# Altium schematic sheet ORD_CONNECTORS.SchDoc
size 420 x 297 mm; Address1: Address1; Address2: Address2; Address3: Address3; Address4: Address4; DocumentNumber: АБВГ.123456.001 Э3; SheetNumber: 1; Scale: 1:1; DocumentType: Схема электрическая принципиальная; FirstReferrence: АБВГ.123456.001
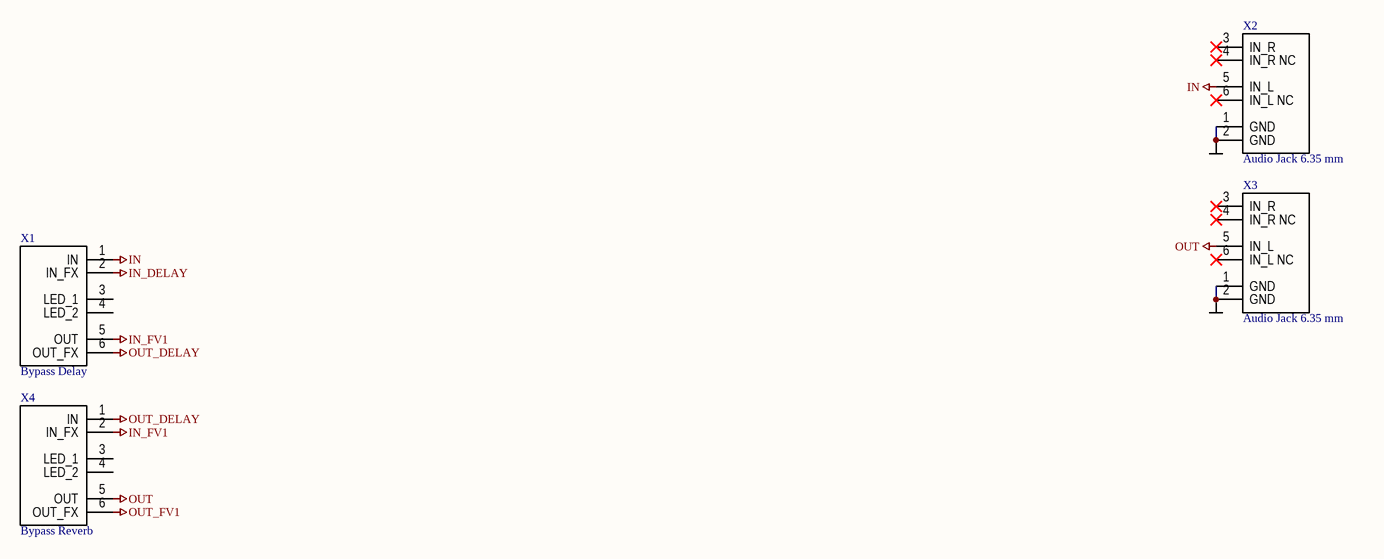
[diagram p0: ORD_CONNECTORS.SchDoc]

## Parts
X1  Bypass Delay  [BYPASS PANEL]
X2  Audio Jack 6.35 mm  [audio jack]
X3  Audio Jack 6.35 mm  [audio jack]
X4  Bypass Reverb  [BYPASS PANEL]

## Nets
GND: X2.1(GND) X2.2(GND) X3.1(GND) X3.2(GND)
IN: X1.1(IN) X2.5(IN_L)
IN_DELAY: X1.2(IN_FX)
IN_FV1: X1.5(OUT) X4.2(IN_FX)
OUT: X3.5(IN_L) X4.5(OUT)
OUT_DELAY: X1.6(OUT_FX) X4.1(IN)
OUT_FV1: X4.6(OUT_FX)

Not connected (* = marked no-connect by the designer): X1 3(LED_1) 4(LED_2); X2 3(IN_R)* 4(IN_R_NC)* 6(IN_L_NC)*; X3 3(IN_R)* 4(IN_R_NC)* 6(IN_L_NC)*; X4 3(LED_1) 4(LED_2)

## Notes on the sheet
- Перв. примен.
- Справ. №
- Подп. и дата
- Инв. № дубл.
- Взам. инв. №
- Разраб.
- Изм.
- Лист
- № докум.
- Подп.
- Дата
- Лит.
- Масса
- Масштаб
- Пров.
- Т.контр.
- Листов
- Инв. № подл.
- Утв.
- Н.контр.
- 2.106-A3
- Копировал
- Формат А3

## Library data of the parts
X1 X4 = Bypass: Rele or 3PDT
X2 X3 = Audio Jack